# Altium project 2004 LCD.PrjPcb
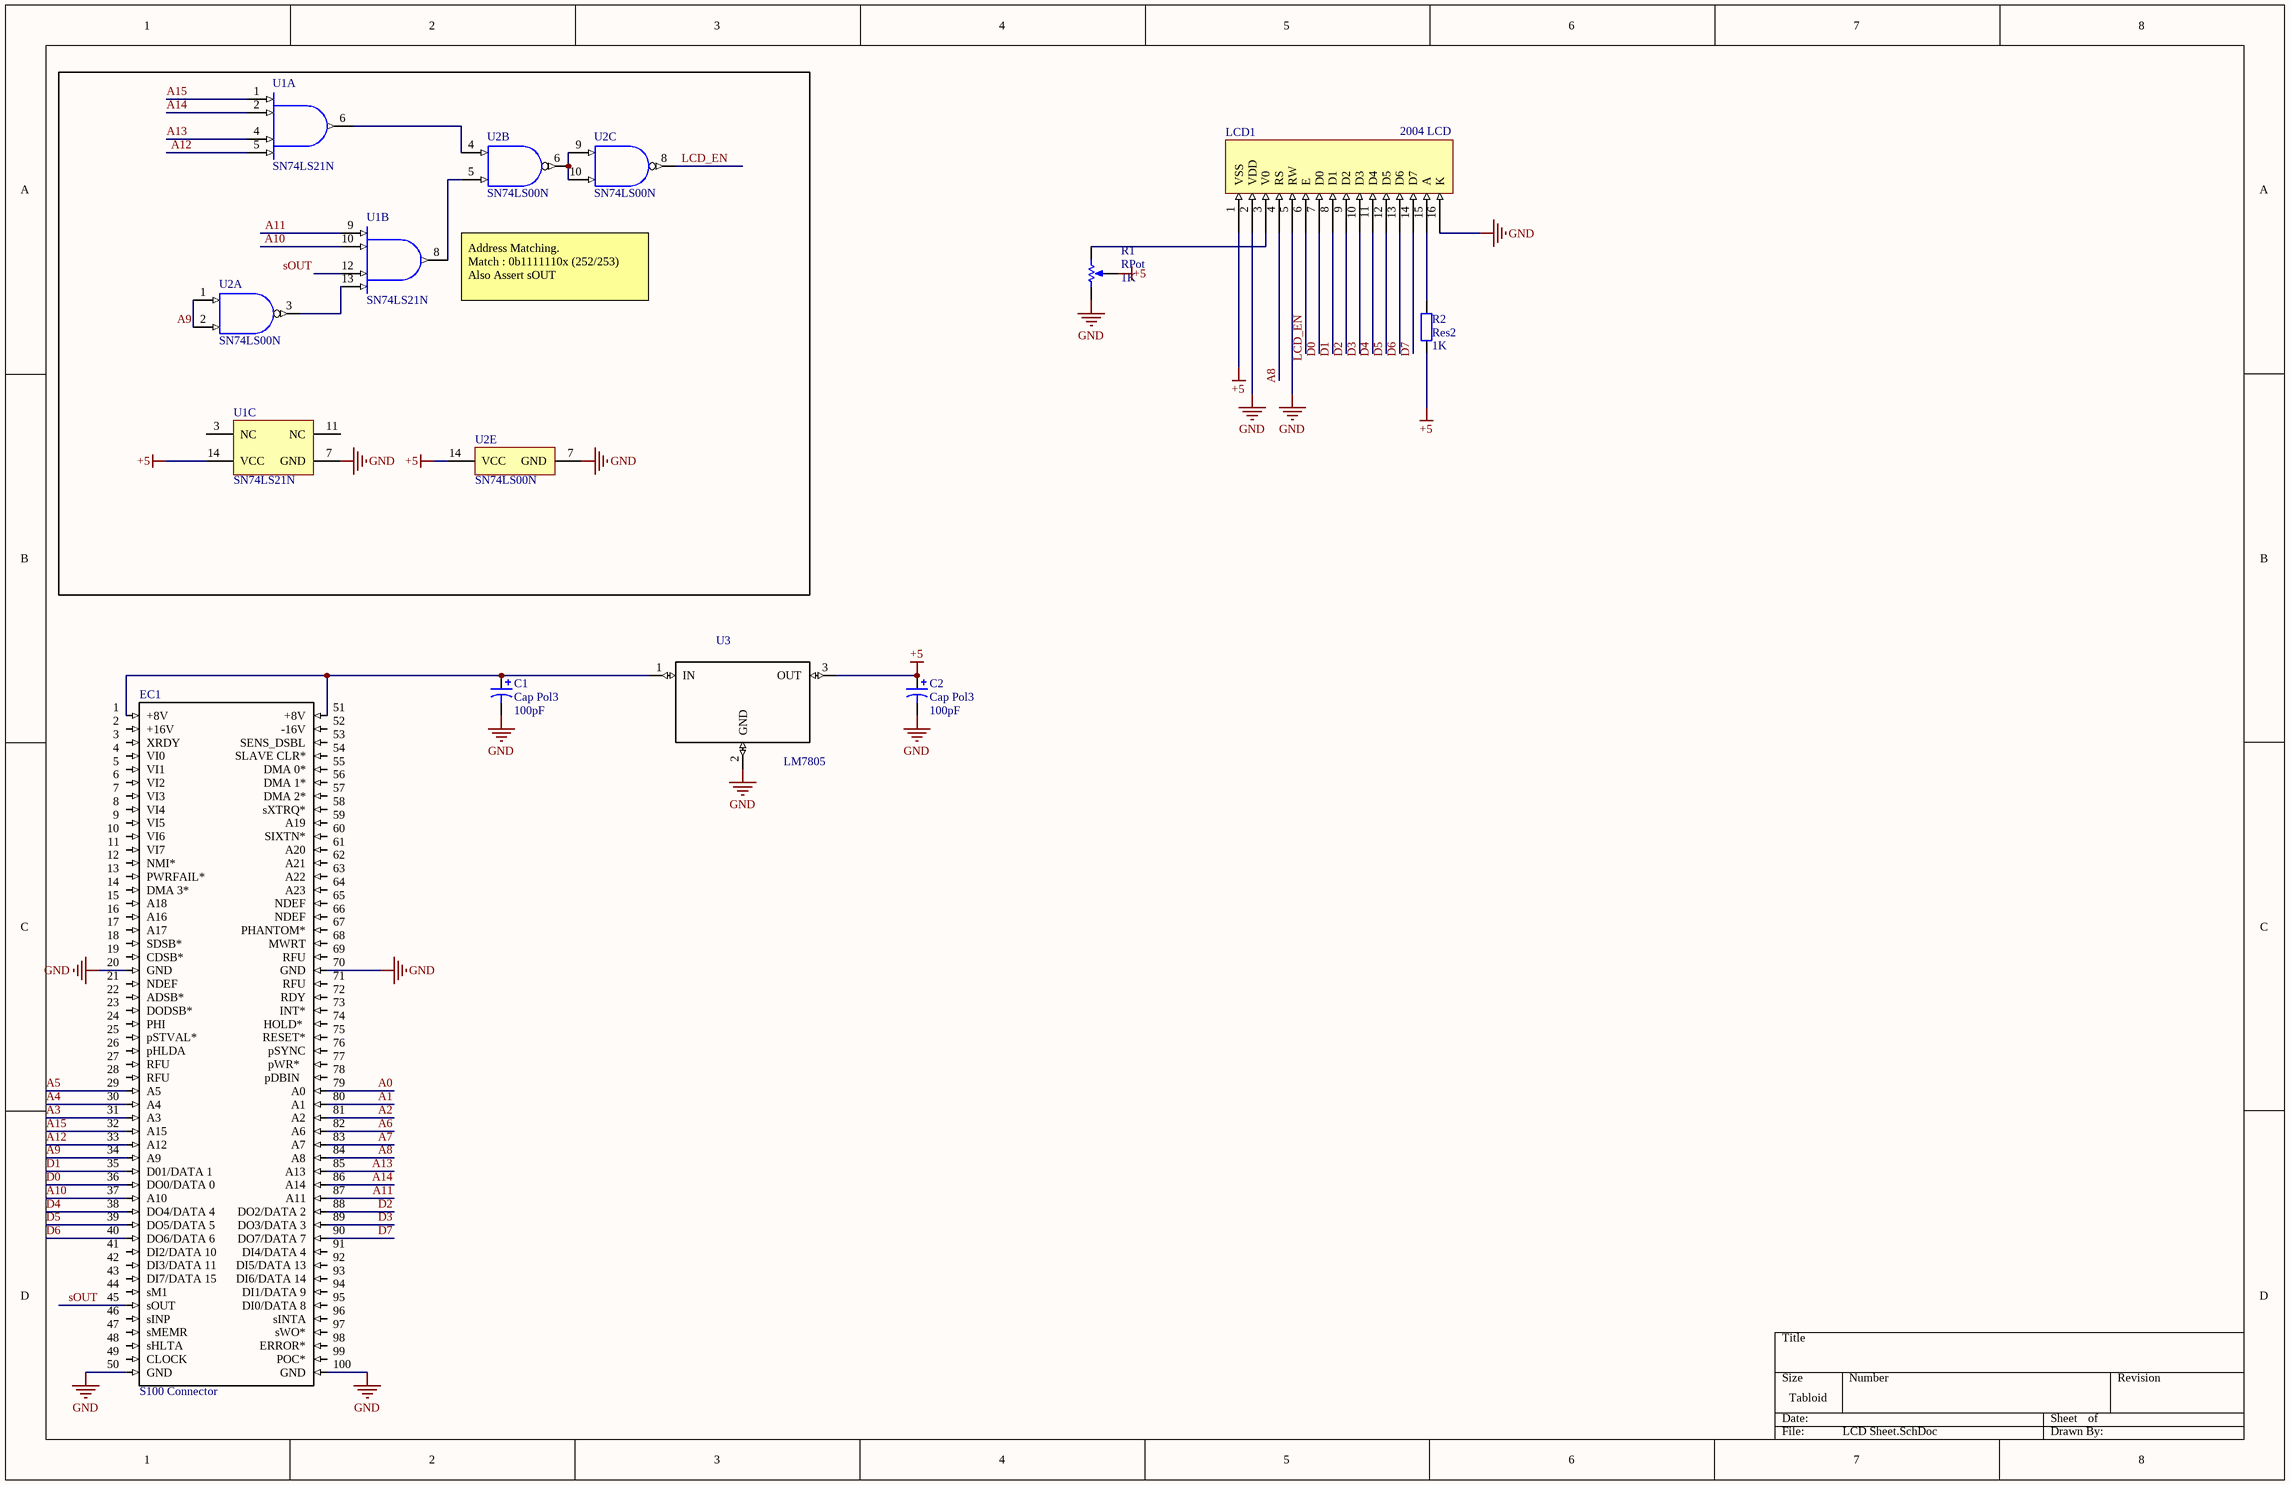
[diagram p0: LCD Sheet.SchDoc]
1 sheet, 9 parts. Net scope: global (net labels, ports and power ports of the same name join across sheets).
Board file: 2004 LCD.PcbDoc

## Sheet LCD Sheet.SchDoc
size Tabloid

### Parts
C1  Cap Pol3  value 100pF  [C0805]
C2  Cap Pol3  value 100pF  [C0805]
EC1  S100 Connector  [S100]
LCD1  2004 LCD  [2004LCD]
R1  RPot  value 1K  [VR5]
R2  Res2  value 1K  [AXIAL-0.4]
U1  SN74LS21N  [N0014A]  (parts A,B,C of 3)
U2  SN74LS00N  [N0014A]  (parts A,B,C,E of 5)
U3  LM7805  [*TO220]

### Nets
+5: C2.1 LCD1.1(VSS) R1.3(TAP) R2.1 U1.14(VCC) U2.14(VCC) U3.3(OUT)
GND: C1.2 C2.2 EC1.20(GND) EC1.50(GND) EC1.70(GND) EC1.100(GND) LCD1.2(VDD) LCD1.5(RW) LCD1.16(K) R1.1(TOP) U1.7(GND) U2.7(GND) U3.2(GND)
A0: EC1.79(A0)
A1: EC1.80(A1)
A2: EC1.81(A2)
A3: EC1.31(A3)
A4: EC1.30(A4)
A5: EC1.29(A5)
A6: EC1.82(A6)
A7: EC1.83(A7)
A8: EC1.84(A8) LCD1.4(RS)
A9: EC1.34(A9) U2.1(1A) U2.2(1B)
A10: EC1.37(A10) U1.10(2B)
A11: EC1.87(A11) U1.9(2A)
A12: EC1.33(A12) U1.5(1D)
A13: EC1.85(A13) U1.4(1C)
A14: EC1.86(A14) U1.2(1B)
A15: EC1.32(A15) U1.1(1A)
D0: EC1.36(DO0/DATA_0) LCD1.7(D0)
D1: EC1.35(D01/DATA_1) LCD1.8(D1)
D2: EC1.88(DO2/DATA_2) LCD1.9(D2)
D3: EC1.89(DO3/DATA_3) LCD1.10(D3)
D4: EC1.38(DO4/DATA_4) LCD1.11(D4)
D5: EC1.39(DO5/DATA_5) LCD1.12(D5)
D6: EC1.40(DO6/DATA_6) LCD1.13(D6)
D7: EC1.90(DO7/DATA_7) LCD1.14(D7)
LCD_EN: LCD1.6(E) U2.8(3Y)
sOUT: EC1.45(sOUT) U1.12(2C)
NetC1_1: C1.1 EC1.1(+8V) EC1.51(+8V) U3.1(IN)
NetLCD1_3: LCD1.3(V0) R1.2(BOT)
NetLCD1_15: LCD1.15(A) R2.2
NetU1_6: U1.6(1Y) U2.4(2A)
NetU1_8: U1.8(2Y) U2.5(2B)
NetU1_13: U1.13(2D) U2.3(1Y)
NetU2_6: U2.6(2Y) U2.9(3A) U2.10(3B)

Not connected (* = marked no-connect by the designer): EC1 2(+16V) 3(XRDY) 4(VI0) 5(VI1) 6(VI2) 7(VI3) 8(VI4) 9(VI5) 10(VI6) 11(VI7) 12(NMI*) 13(PWRFAIL*) 14(DMA_3*) 15(A18 ) 16(A16  ) 17(A17) 18(SDSB*) 19(CDSB*) 21(NDEF) 22(ADSB*) 23(DODSB*) 24(PHI) 25(pSTVAL*) 26(pHLDA) 27(RFU) 28(RFU) 41(DI2/DATA_10) 42(DI3/DATA_11) 43(DI7/DATA_15) 44(sM1) 46(sINP) 47(sMEMR) 48(sHLTA) 49(CLOCK ) 52(-16V) 53(SENS_DSBL) 54(SLAVE_CLR*) 55(DMA_0*) 56(DMA_1*) 57(DMA_2*) 58(sXTRQ*) 59(A19) 60(SIXTN*) 61(A20) 62(A21) 63(A22) 64(A23) 65(NDEF) 66(NDEF) 67(PHANTOM*) 68(MWRT) 69(RFU) 71(RFU) 72(RDY) 73(INT*) 74(HOLD* ) 75(RESET*) 76(pSYNC) 77(pWR*  ) 78(pDBIN  ) 91(DI4/DATA_4) 92(DI5/DATA_13) 93(DI6/DATA_14) 94(DI1/DATA_9) 95(DI0/DATA_8) 96(sINTA) 97(sWO*) 98(ERROR*) 99(POC*); U1 3(NC) 11(NC)

### Notes on the sheet
- Address Matching.
  Match : 0b1111110x (252/253)
  Also Assert sOUT

### Library data of the parts
C1 C2 = Cap Pol3: Polarized Capacitor (Surface Mount); Published: 8-Jun-2000; LatestRevisionDate: 29-May-2009; LatestRevisionNote: IPC-7351 Footprint Added.; PackageReference: C0805; Publisher: Altium Limited; PackageDescription: Chip Capacitor
R1 = RPot: Potentiometer; Sim Note: Enter the Resistance value and the set point into parameter fields.; Set Position: 0.5; Published: 8-Jun-2000; LatestRevisionDate: 17-Jul-2002; LatestRevisionNote: Re-released for DXP Platform.; PackageReference: VR5; Publisher: Altium Limited; PackageDescription: Variable Resistor, Thru-Hole; 3 Leads
R2 = Res2: Resistor; Published: 8-Jun-2000; LatestRevisionDate: 17-Jul-2002; LatestRevisionNote: Re-released for DXP Platform.; PackageReference: AXIAL-0.4; Publisher: Altium Limited; PackageDescription: Axial Device, Thru-Hole; 2 Leads; 0.4 in Pin Spacing
U1 = SN74LS21N: Dual 4-input positive-AND gates, N0014A, TUBE; Manufacturer: Texas Instruments; VCC(Min)(V): 4.75; VCC(Max)(V): 5.25; Output Type: TTL; ICC @ Nom Voltage(Max)(mA): 0.0025; Bits(#): 2; F @ Nom Voltage(Max)(Mhz): 35; Rating: Catalog; Technology Family: LS; Voltage(Nom)(V): 5; Schmitt Trigger: No; Output Drive (IOL/IOH)(Max)(mA): -.04/8; tpd @ Nom Voltage(Max)(ns): 15; DatasheetVersion: SDLS139; PackageReference: N0014A; Supplier 1: Mouser; Supplier Part Number 1: 595-SN74LS21N; Supplier 2: Digi-Key; Supplier Part Number 2: 296-3672-5-ND; Generic Part Number: SN74LS21; Input Type: TTL; Operating Temperature Range(C): 0 to 70; PartNumber: SN74LS21N; ComponentLink1Description: Manufacturer URL; ComponentLink1URL: http://www.ti.com/; ComponentLink2Description: Datasheet; ComponentLink2URL: http://www.ti.com/lit/ds/symlink/sn74ls21.pdf
U2 = SN74LS00N: Quad 2-input positive-NAND gates, N0014A, TUBE; Manufacturer: Texas Instruments; VCC(Min)(V): 4.75; VCC(Max)(V): 5.25; Output Type: TTL; ICC @ Nom Voltage(Max)(mA): 0.022; Bits(#): 4; F @ Nom Voltage(Max)(Mhz): 35; Rating: Catalog; Technology Family: LS; Voltage(Nom)(V): 5; Schmitt Trigger: No; Output Drive (IOL/IOH)(Max)(mA): 0.4/-16; tpd @ Nom Voltage(Max)(ns): 22; DatasheetVersion: SDLS025B; PackageReference: N0014A; Supplier 1: Mouser; Supplier Part Number 1: 595-SN74LS00N; Supplier 2: Digi-Key; Supplier Part Number 2: 296-1626-5-ND; Generic Part Number: SN74LS00; Input Type: TTL; Operating Temperature Range(C): 0 to 70; Code_JEDEC: MS-001; PartNumber: SN74LS00N; ComponentLink1Description: Manufacturer URL; ComponentLink1URL: http://www.ti.com/; ComponentLink2Description: Datasheet; ComponentLink2URL: http://www.ti.com/lit/ds/symlink/sn74ls00.pdf; ComponentLink3Description: Package Specification; ComponentLink3URL: http://www.ti.com/lit/ml/mpdi002c/mpdi002c.pdf
U3 = LM7805: Power Management, Linear Regulators, Semiconductors and Actives; MF: Fairchild Semiconductor; Price: None; Availability: Unavailable; SnapEDA_Link: https://www.snapeda.com/parts/LM7805/Fairchild%20Semiconductor/view-part/?ref=snap; MP: LM7805; Package: None; Value: *